# EAGLE design main_indoor_sensor (EAGLE 6.5.0)
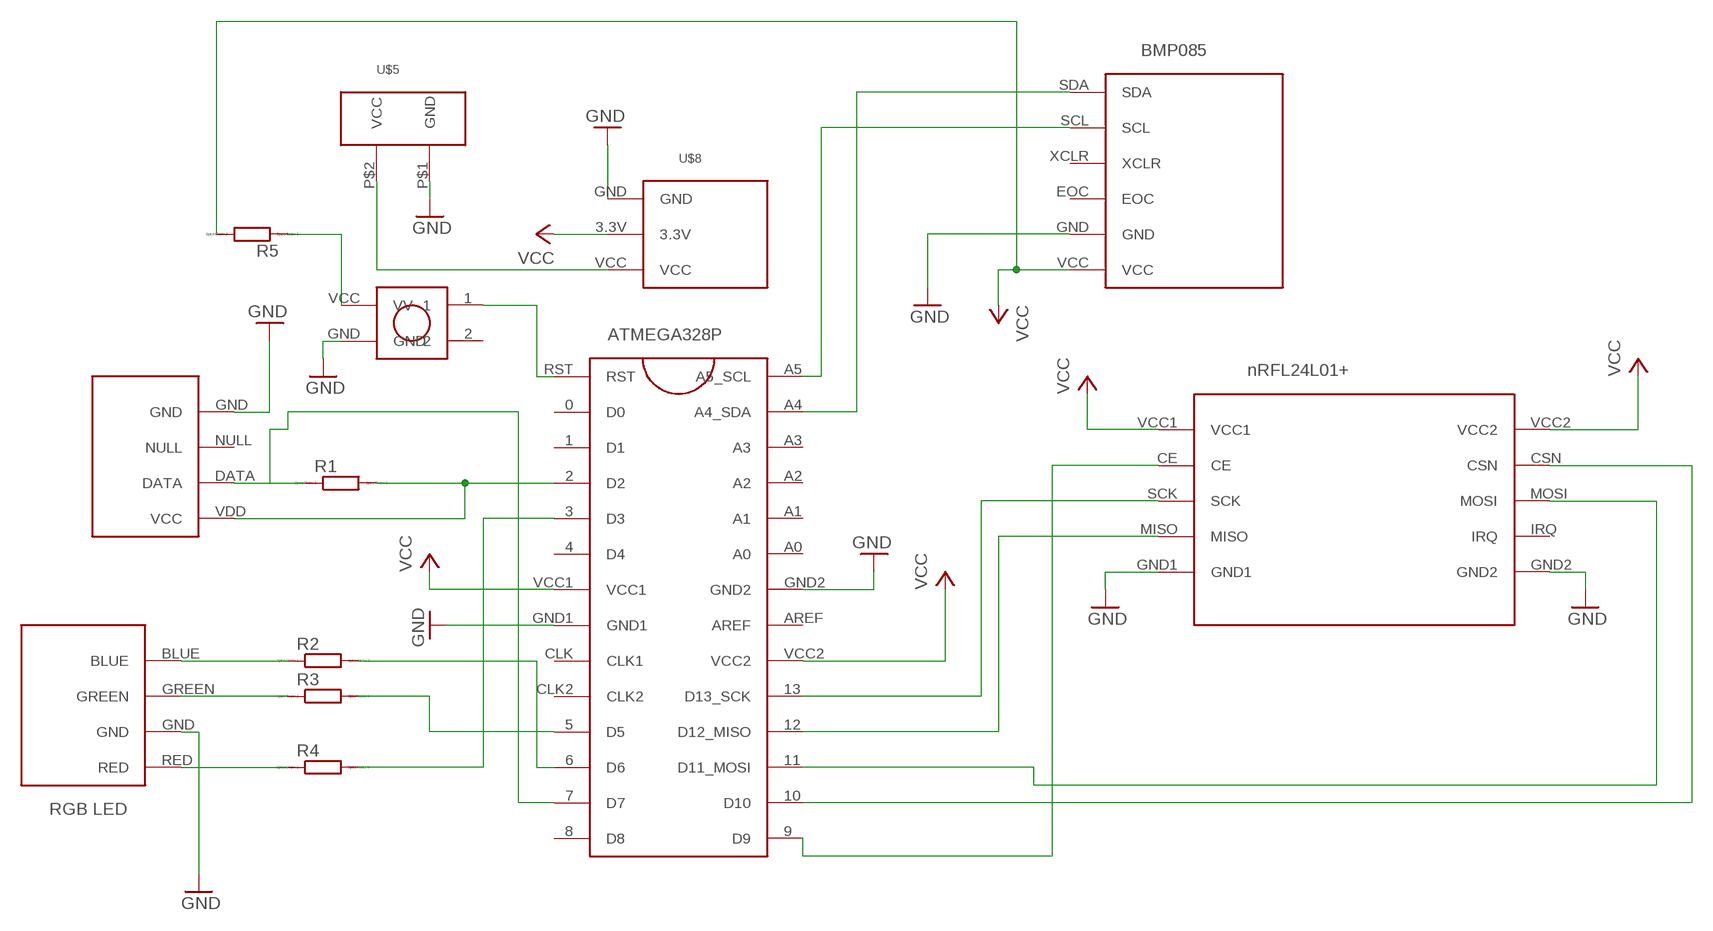
[diagram p0: schematic, sheet 1]

## Parts
R1  R0204/7  [0204/7]
R2  R0204/7  [0204/7]
R3  R0204/7  [0204/7]
R4  R0204/7  [0204/7]
R5  R0204/7  [0204/7]
U$1  ATMEGA328PARDUINO  [ATMEGA328P]
U$2  BMP085SPARKFUN  [BMP085]
U$3  DHT22WHITE  [DHT22]
U$4  NRF24L0110PINS  [NRF24L01]
U$5  2PINCONNECTORSIMPLE  [2PINCONNECTOR]
U$6  RGB_LED5MM  [RGB_LED]
U$7  KRS0612PUSH  [KRS0612]
U$8  NCP1402SPARKFUN  [NCP1402]

## Nets
GND: U$1.GND1 U$1.GND2 U$2.GND U$3.GND U$4.GND1 U$4.GND2 U$5.P$1(GND) U$6.GND U$7.GND U$8.GND
N$1: U$1.A4(A4_SDA) U$2.SDA
N$2: U$1.A5(A5_SCL) U$2.SCL
N$3: U$1.13(D13_SCK) U$4.SCK
N$4: U$1.12(D12_MISO) U$4.MISO
N$5: U$1.11(D11_MOSI) U$4.MOSI
N$6: R1.2 U$1.2(D2) U$3.VDD(VCC)
N$7: R1.1 U$1.7(D7) U$3.DATA
N$8: R4.2 U$1.3(D3)
N$9: R2.1 U$6.BLUE
N$10: R3.1 U$6.GREEN
N$11: R2.2 U$1.6(D6)
N$12: R3.2 U$1.5(D5)
N$13: R4.1 U$6.RED
N$14: U$1.10(D10) U$4.CSN
N$15: U$1.9(D9) U$4.CE
N$16: U$1.RST U$7.1
N$17: U$5.P$2(VCC) U$8.VCC
N$19: R5.1 U$7.VCC(VV)
RASTNEST: R5.2 U$1.VCC1 U$1.VCC2 U$2.VCC U$4.VCC1 U$4.VCC2 U$8.3.3V ; supply symbol labelled VCC
Unconnected: U$1.0(D0) U$1.1(D1) U$1.4(D4) U$1.8(D8) U$1.A0 U$1.A1 U$1.A2 U$1.A3 U$1.AREF U$1.CLK2 U$1.CLK(CLK1) U$2.EOC U$2.XCLR U$3.NULL U$4.IRQ U$7.2

## Library data of the parts
R1-R5 = eagle-ltspice:R: RESISTOR, European symbol; SPICEMODEL: NONE; SPICEPREFIX: R
U$1 = piweather:ATMEGA328P
U$2 = piweather:BMP085
U$3 = piweather:DHT22
U$4 = piweather:NRF24L01
U$5 = piweather:2PINCONNECTOR
U$6 = piweather:RGB_LED
U$7 = piweather:KRS0612
U$8 = piweather:NCP1402

## Board
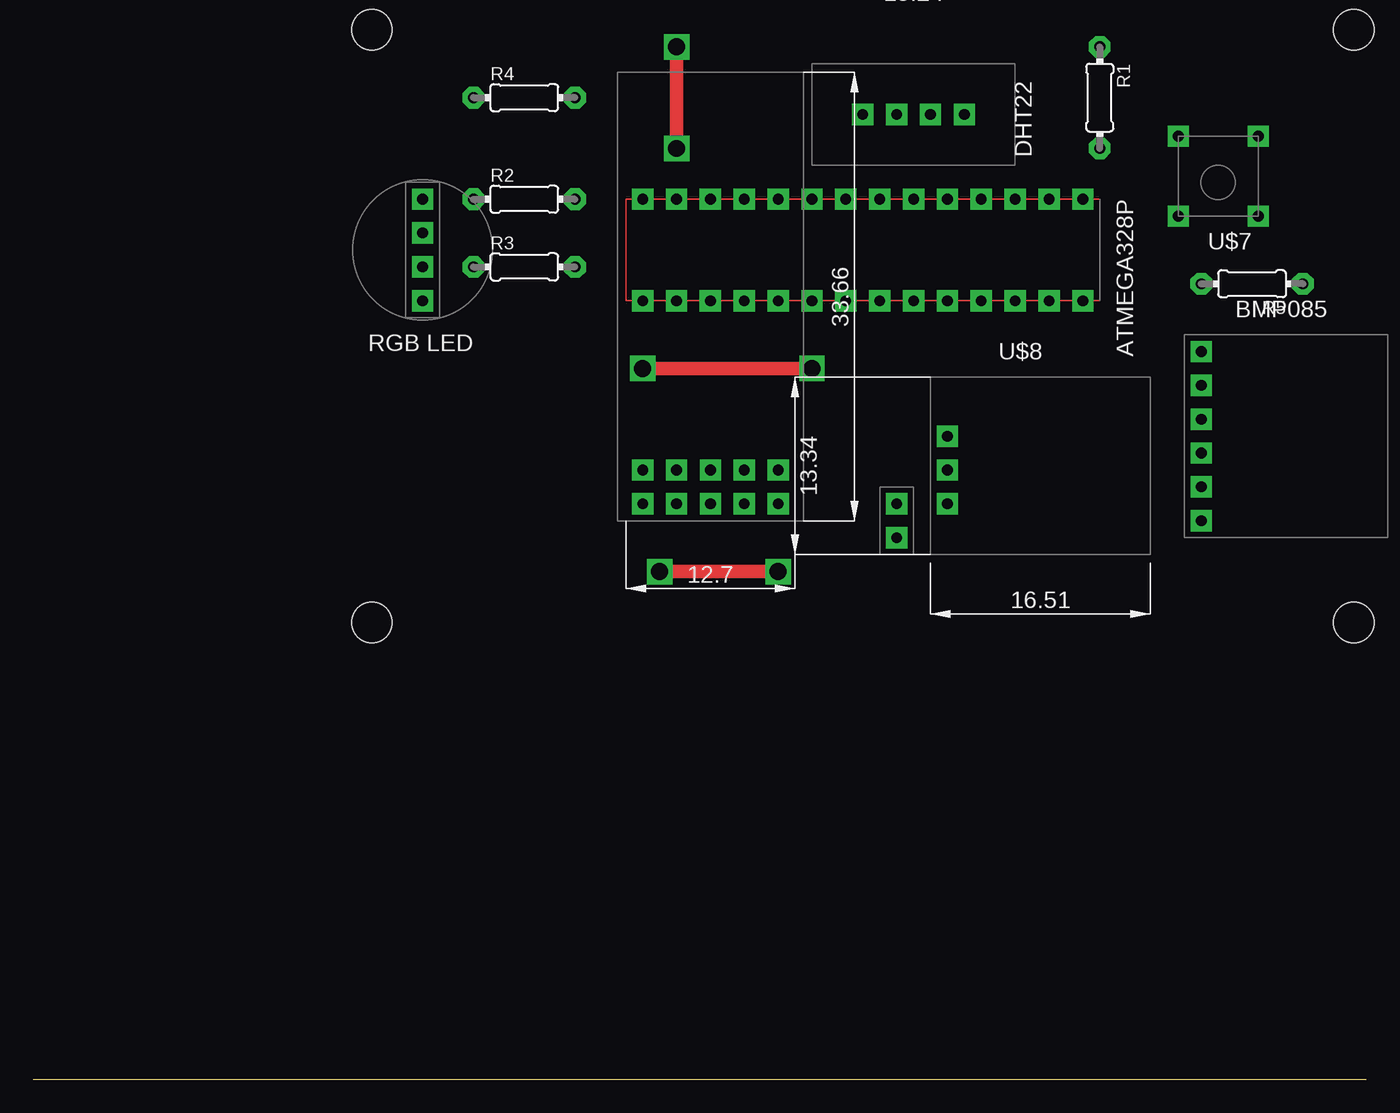
[diagram p1: board, top side]
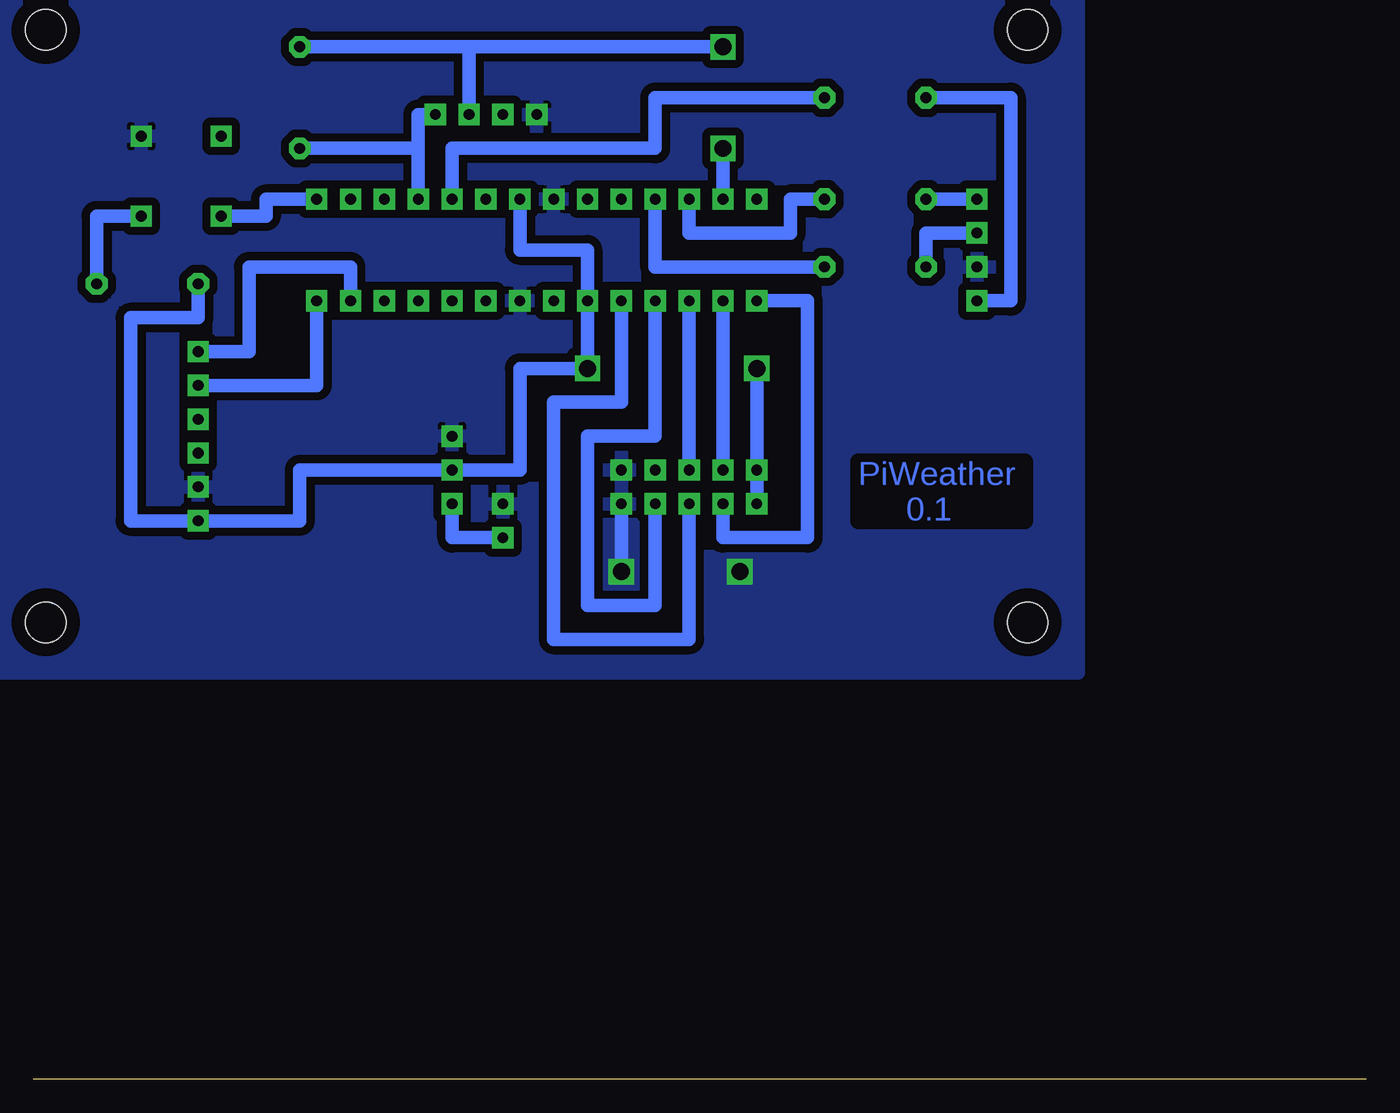
[diagram p2: board, bottom side, seen from below]

Size 100 x 0 mm. Coordinates in mm from the lower left corner, seen from the top.
Outline: 0,0 100,0
Copper layers (1*16): Top 0.035mm / dielectric 2mm / Bottom 0.035mm
Design rules "default *": minimum track width 10mil, minimum drill 24mil, track to track 3mil, track to pad 1mil, pad to pad 8mil, via to via 8mil, smd to smd 8mil, copper to edge 40mil, drill to drill 8mil, minimum pad ring 10mil, minimum via ring 8mil, stop-mask expansion 4mil, vias tented up to drill 0mil, thermal gap 10mil
Holes 3.05 mm at 25.4,78.74 25.4,34.29 99.06,34.29 99.06,78.74

### Footprints (pad centres in the part's own frame; a part is rotated, then mirrored left to right if it is on the bottom)
0204/7 = drill 0.813 octagon: 1 -3.81,0; 2 3.81,0
ATMEGA328P = drill 0.8 square: 0 -3.81,11.43; 1 -3.81,8.89; 2 -3.81,6.35; 3 -3.81,3.81; 4 -3.81,1.27; 5 -3.81,-11.43; 6 -3.81,-13.97; 7 -3.81,-16.51; 8 -3.81,-19.05; 9 3.81,-19.05; 10 3.81,-16.51; 11 3.81,-13.97; 12 3.81,-11.43; 13 3.81,-8.89; A0 3.81,1.27; A1 3.81,3.81; A2 3.81,6.35; A3 3.81,8.89; A4 3.81,11.43; A5 3.81,13.97; AREF 3.81,-3.81; CLK -3.81,-6.35; CLK2 -3.81,-8.89; GND1 -3.81,-3.81; GND2 3.81,-1.27; RST -3.81,13.97; VCC1 -3.81,-1.27; VCC2 3.81,-6.35
BMP085 = drill 0.8 square: EOC -5.08,-1.27; GND -5.08,-3.81; SCL -5.08,3.81; SDA -5.08,6.35; VCC -5.08,-6.35; XCLR -5.08,1.27
DHT22 = drill 0.8 square: DATA -2.54,5.08; GND -2.54,0; NULL -2.54,2.54; VDD -2.54,7.62
NRF24L01 = drill 0.8 square: CE -16.51,2.54; CSN -13.97,2.54; GND1 -16.51,-5.08; GND2 -13.97,-5.08; IRQ -13.97,-2.54; MISO -16.51,-2.54; MOSI -13.97,0; SCK -16.51,0; VCC1 -16.51,5.08; VCC2 -13.97,5.08
2PINCONNECTOR = drill 0.8 square: P$1 -1.27,0; P$2 1.27,0
RGB_LED = drill 0.8 square: BLUE 0,-3.81; GND 0,1.27; GREEN 0,-1.27; RED 0,3.81
KRS0612 = drill 0.8 square: 1 3,0; 2 3,-6; GND -3,-6; VCC -3,0
NCP1402 = drill 0.8 square: 3.3V -2.54,-0.635; GND -2.54,1.905; VCC -2.54,-3.175

### Placement (x,y rotation side)
R1  80.01,73.66 270 top  (outside the outline)
R2  36.83,66.04 0 top  (outside the outline)
R3  36.83,60.96 0 top  (outside the outline)
R4  36.83,73.66 0 top  (outside the outline)
R5  91.44,59.69 180 top  (outside the outline)
U$1  64.77,62.23 270 top  (outside the outline)
U$2  92.71,48.26 0 top  (outside the outline)
U$3  62.23,69.85 270 top  (outside the outline)
U$4  50.8,59.69 90 top  (outside the outline)
U$5  64.77,41.91 270 top  (outside the outline)
U$6  29.21,62.23 180 top  (outside the outline)
U$7  88.9,64.77 180 top  (outside the outline)
U$8  71.12,46.35 0 top  (outside the outline)

### Tracks (layer width: path | path; a pad name or v marks a point on that pad's centre or on a via)
GND  (via drill 1.27)
  Top 1.016: v55.88,38.1 v46.99,38.1
  Bottom 1.016: U$4.GND1 v55.88,38.1
  pour Bottom (isolate 0.61): 21.59,82.55 21.59,30.48 102.87,30.48 102.87,82.55
N$1
  Bottom 1.016: U$1.A4 76.2,60.96 83.82,60.96 83.82,54.61 U$2.SDA
N$2
  Bottom 1.016: U$1.A5 78.74,52.07 U$2.SCL
N$3
  Bottom 1.016: U$1.13 55.88,50.8 60.96,50.8 60.96,33.02 50.8,33.02 U$4.SCK
N$4
  Bottom 1.016: U$1.12 53.34,48.26 58.42,48.26 58.42,35.56 53.34,35.56 U$4.MISO
N$5
  Bottom 1.016: U$1.11 U$4.MOSI
N$6
  Bottom 1.016: U$3.VDD 71.12,72.39 71.12,69.85 | 71.12,69.85 U$1.2 | R1.2 71.12,69.85
N$7  (via drill 1.27)
  Top 1.016: v48.26,77.47 v48.26,69.85
  Bottom 1.016: U$3.DATA 67.31,77.47 | 67.31,77.47 R1.1 | v48.26,77.47 67.31,77.47 | U$1.7 v48.26,69.85
N$8
  Bottom 1.016: R4.2 53.34,73.66 53.34,69.85 68.58,69.85 U$1.3
N$9
  Bottom 1.016: U$6.BLUE R2.1
N$10
  Bottom 1.016: U$6.GREEN 33.02,63.5 R3.1
N$11
  Bottom 1.016: R2.2 43.18,66.04 43.18,63.5 50.8,63.5 U$1.6
N$12
  Bottom 1.016: R3.2 53.34,60.96 U$1.5
N$13
  Bottom 1.016: R4.1 26.67,73.66 26.67,58.42 U$6.RED
N$14
  Bottom 1.016: U$4.CSN U$1.10
N$15
  Bottom 1.016: U$4.CE 48.26,40.64 41.91,40.64 41.91,58.42 U$1.9
N$16
  Bottom 1.016: U$1.RST 82.55,66.04 82.55,64.77 U$7.1
N$17
  Bottom 1.016: U$5.P$2 68.58,40.64 U$8.VCC
N$19
  Bottom 1.016: U$7.VCC 95.25,64.77 R5.1
RASTNEST  (via drill 1.27)
  Top 1.016: v45.72,53.34 v58.42,53.34
  Bottom 1.016: v45.72,53.34 U$4.VCC2 U$4.VCC1 | U$1.VCC1 63.5,62.23 58.42,62.23 U$1.VCC2 v58.42,53.34 63.5,53.34 63.5,45.72 U$8.3.3V 80.01,45.72 80.01,41.91 U$2.VCC 92.71,41.91 92.71,57.15 87.63,57.15 R5.2

### Text on the board
Bottom: PiWeather / 0.1